# Altium schematic sheet FPGA - Decoupling.SchDoc
size A4
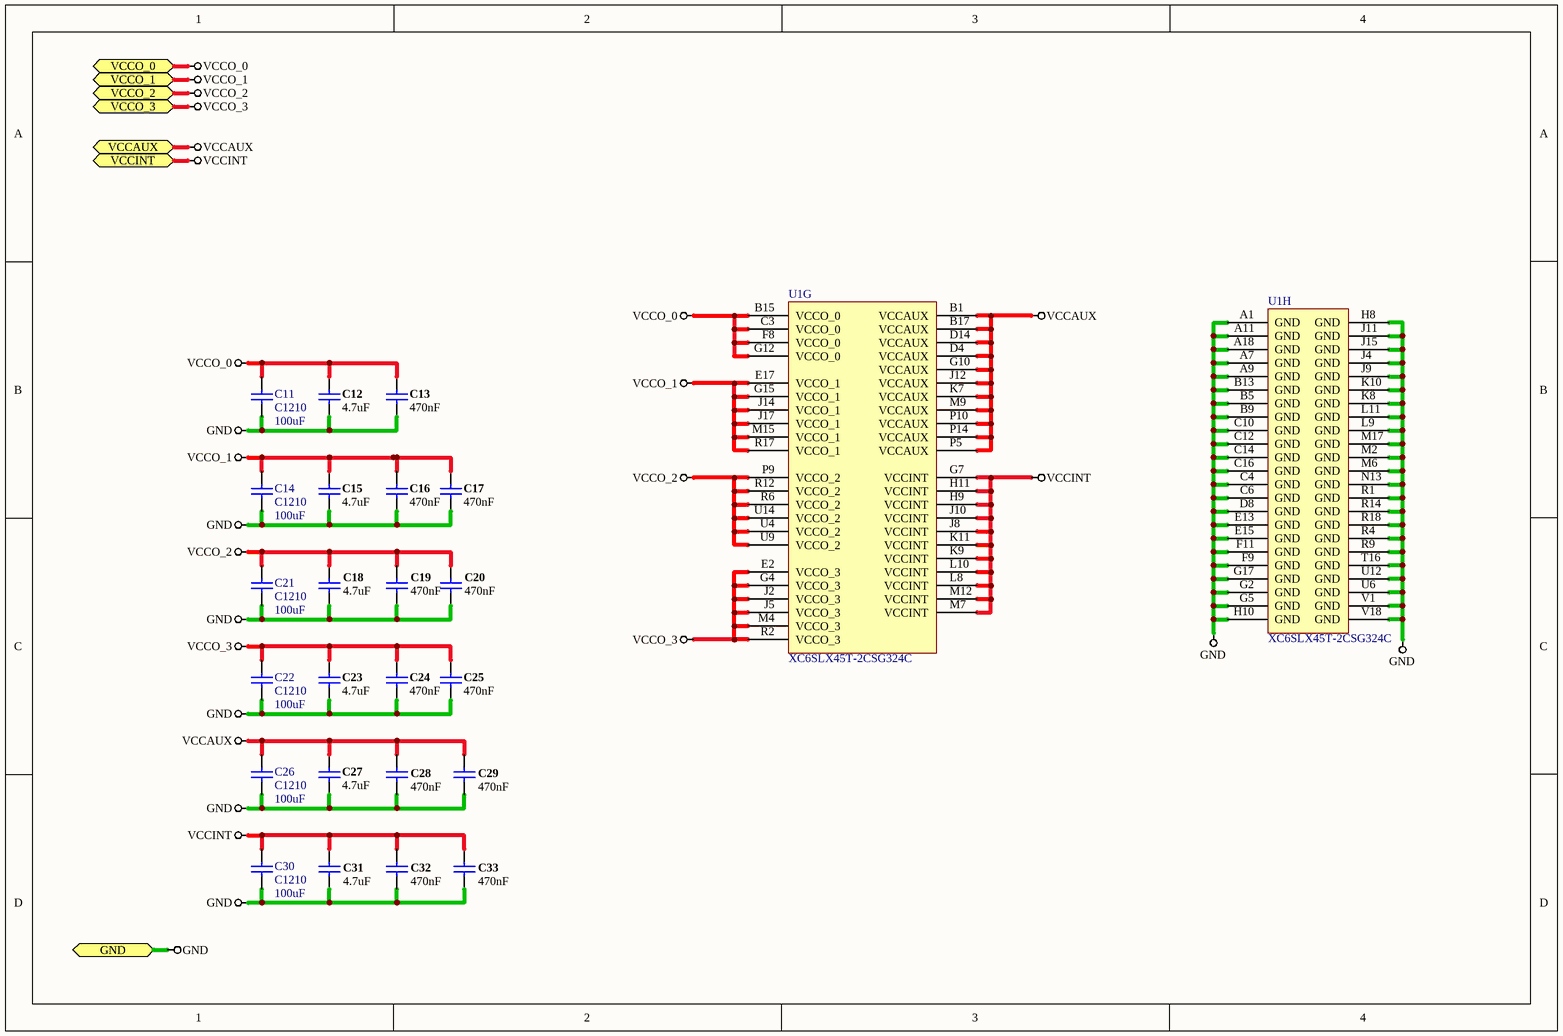
[diagram p0: FPGA - Decoupling.SchDoc]

## Parts
C11  C1210  value 100uF  [C-1210]
C12  value 4.7uF  [CAPC0603(1608)55_L]  (hidden comment: CAP 4.7uF 10V 0603(1608))
C13  value 470nF  [CAPC0402(1005)60_L]  (hidden comment: CAP 470nF 10V 0402(1005))
C14  C1210  value 100uF  [C-1210]
C15  value 4.7uF  [CAPC0603(1608)55_L]  (hidden comment: CAP 4.7uF 10V 0603(1608))
C16  value 470nF  [CAPC0402(1005)60_L]  (hidden comment: CAP 470nF 10V 0402(1005))
C17  value 470nF  [CAPC0402(1005)60_L]  (hidden comment: CAP 470nF 10V 0402(1005))
C18  value 4.7uF  [CAPC0603(1608)55_L]  (hidden comment: CAP 4.7uF 10V 0603(1608))
C19  value 470nF  [CAPC0402(1005)60_L]  (hidden comment: CAP 470nF 10V 0402(1005))
C20  value 470nF  [CAPC0402(1005)60_L]  (hidden comment: CAP 470nF 10V 0402(1005))
C21  C1210  value 100uF  [C-1210]
C22  C1210  value 100uF  [C-1210]
C23  value 4.7uF  [CAPC0603(1608)55_L]  (hidden comment: CAP 4.7uF 10V 0603(1608))
C24  value 470nF  [CAPC0402(1005)60_L]  (hidden comment: CAP 470nF 10V 0402(1005))
C25  value 470nF  [CAPC0402(1005)60_L]  (hidden comment: CAP 470nF 10V 0402(1005))
C26  C1210  value 100uF  [C-1210]
C27  value 4.7uF  [CAPC0603(1608)55_L]  (hidden comment: CAP 4.7uF 10V 0603(1608))
C28  value 470nF  [CAPC0402(1005)60_L]  (hidden comment: CAP 470nF 10V 0402(1005))
C29  value 470nF  [CAPC0402(1005)60_L]  (hidden comment: CAP 470nF 10V 0402(1005))
C30  C1210  value 100uF  [C-1210]
C31  value 4.7uF  [CAPC0603(1608)55_L]  (hidden comment: CAP 4.7uF 10V 0603(1608))
C32  value 470nF  [CAPC0402(1005)60_L]  (hidden comment: CAP 470nF 10V 0402(1005))
C33  value 470nF  [CAPC0402(1005)60_L]  (hidden comment: CAP 470nF 10V 0402(1005))
U1  XC6SLX45T-2CSG324C  [CSG324]  (parts G,H of 8)

## Ports
GND, VCCAUX, VCCINT, VCCO_0, VCCO_1, VCCO_2, VCCO_3

## Nets
GND: C11.1 C12.1 C13.1 C14.1 C15.1 C16.1 C17.1 C18.1 C19.1 C20.1 C21.1 C22.1 C23.1 C24.1 C25.1 C26.1 C27.2 C28.2 C29.2 C30.1 C31.2 C32.2 C33.2 U1.A1(GND) U1.A7(GND) U1.A9(GND) U1.A11(GND) U1.A18(GND) U1.B5(GND) U1.B9(GND) U1.B13(GND) U1.C4(GND) U1.C6(GND) U1.C10(GND) U1.C12(GND) U1.C14(GND) U1.C16(GND) U1.D8(GND) U1.E13(GND) U1.E15(GND) U1.F9(GND) U1.F11(GND) U1.G2(GND) U1.G5(GND) U1.G17(GND) U1.H8(GND) U1.H10(GND) U1.J4(GND) U1.J9(GND) U1.J11(GND) U1.J15(GND) U1.K8(GND) U1.K10(GND) U1.L9(GND) U1.L11(GND) U1.M2(GND) U1.M6(GND) U1.M17(GND) U1.N13(GND) U1.R1(GND) U1.R4(GND) U1.R9(GND) U1.R14(GND) U1.R18(GND) U1.T16(GND) U1.U6(GND) U1.U12(GND) U1.V1(GND) U1.V18(GND) ; port GND
VCCAUX: C26.2 C27.1 C28.1 C29.1 U1.B1(VCCAUX) U1.B17(VCCAUX) U1.D4(VCCAUX) U1.D14(VCCAUX) U1.G10(VCCAUX) U1.J12(VCCAUX) U1.K7(VCCAUX) U1.M9(VCCAUX) U1.P5(VCCAUX) U1.P10(VCCAUX) U1.P14(VCCAUX) ; port VCCAUX
VCCINT: C30.2 C31.1 C32.1 C33.1 U1.G7(VCCINT) U1.H9(VCCINT) U1.H11(VCCINT) U1.J8(VCCINT) U1.J10(VCCINT) U1.K9(VCCINT) U1.K11(VCCINT) U1.L8(VCCINT) U1.L10(VCCINT) U1.M7(VCCINT) U1.M12(VCCINT) ; port VCCINT
VCCO_0: C11.2 C12.2 C13.2 U1.B15(VCCO_0) U1.C3(VCCO_0) U1.F8(VCCO_0) U1.G12(VCCO_0) ; port VCCO_0
VCCO_1: C14.2 C15.2 C16.2 C17.2 U1.E17(VCCO_1) U1.G15(VCCO_1) U1.J14(VCCO_1) U1.J17(VCCO_1) U1.M15(VCCO_1) U1.R17(VCCO_1) ; port VCCO_1
VCCO_2: C18.2 C19.2 C20.2 C21.2 U1.P9(VCCO_2) U1.R6(VCCO_2) U1.R12(VCCO_2) U1.U4(VCCO_2) U1.U9(VCCO_2) U1.U14(VCCO_2) ; port VCCO_2
VCCO_3: C22.2 C23.2 C24.2 C25.2 U1.E2(VCCO_3) U1.G4(VCCO_3) U1.J2(VCCO_3) U1.J5(VCCO_3) U1.M4(VCCO_3) U1.R2(VCCO_3) ; port VCCO_3

## Library data of the parts
C11 C14 C21 C22 C26 C30 = C1210: GRM32ER60J107ME20L; Manufacturer Name: Murata; Manufacturer Part Number: GRM32ER60J107ME20L
C12 C15 C18 C23 C27 C31 = CAP 4.7uF 10V ±10% 0603 (1608 Metric) Thickness 0.55mm SMD: Manufacturer_PN: CC0603KRX5R6BB475; Case-Metric: 1608; Case-EIA: 0603; Tolerance: ±10%; Rated Voltage: 10 V; Technology: SMT; Max Thickness: 0.55 mm; Manufacturer Part Number: CC0603KRX5R6BB475
C13 C16 C17 C19 C20 C24 C25 C28 C29 C32 C33 = CAP 470nF 10V ±10% 0402 (1005 Metric) Thickness 0.6mm SMD: Manufacturer_PN: LMK105BJ474KV-F; Case-Metric: 1005; Case-EIA: 0402; Tolerance: ±10%; Rated Voltage: 10 V; Max Thickness: 0.6 mm; Technology: SMT; Manufacturer Part Number: LMK105BJ474KV-F
U1 = XC6SLX45T-2CSG324C: Spartan-6 LXT 1.2V FPGA, 190 User I/Os, 324-Ball Chip-Scale BGA (0.8mm Pitch), Speed Grade 2, Commercial Grade, Pb-Free; Published: 17-Nov-2009; DatasheetVersion: ver1.6, Nov-2010; PackageVersion: ver1.1, Nov-2009; PackageReference: CSG324; Publisher: Altium Limited; PackageDescription: 324-Ball Chip-Scale BGA (CSG324) Package, 0.8 mm Pitch; Supplier 1: Digi-Key; Supplier Part Number 1: XC6SLX45T-2CSG324C-ND; Code_JEDEC: MO-275-KKAC-1; ComponentLink1Description: Manufacturer Link; ComponentLink1URL: http://www.xilinx.com; ComponentLink2Description: Spartan-6 Datasheet; ComponentLink2URL: http://www.xilinx.com/support/documentation/data_sheets/ds160.pdf; ComponentLink3Description: Spartan-6 Documents; ComponentLink3URL: http://www.xilinx.com/support/documentation/spartan-6.htm; ComponentLink4Description: Xilinx.com Home; ComponentLink4URL: http://www.xilinx.com